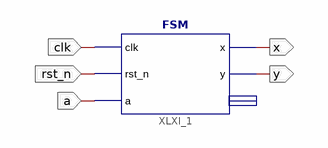
[diagram p0: schematic sheet 1]
// Xilinx ISE schematic Test.sch (spartan3e) as structural Verilog: 1 symbols, 5 ports
module Test (
  input  clk,
  input  rst_n,
  input  a,
  output x,
  output y
);

  FSM XLXI_1 (.clk(clk), .rst_n(rst_n), .a(a), .x(x), .y(y));  // open: debug_state
endmodule
